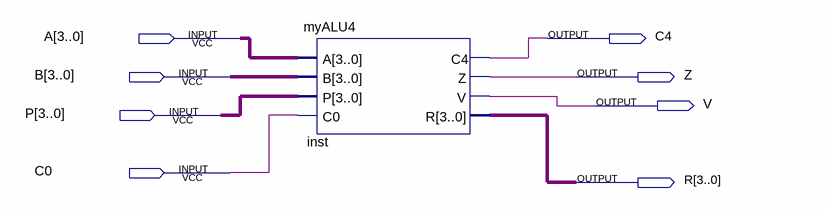
[diagram p0: schematic sheet]
// Quartus schematic Block1.bdf as structural Verilog: 1 symbols, 8 pins
module Block1 (
  input  [3:0] A,
  input  [3:0] B,
  input  [3:0] P,
  input  C0,
  output C4,
  output Z,
  output V,
  output [3:0] R
);

  myALU4 inst (.A(A), .B(B), .P(P), .C0(C0), .C4(C4), .Z(Z), .V(V), .R(R));
endmodule
